# Altium project e-puck3-coreboard.PrjPcb (part 4 of 4)
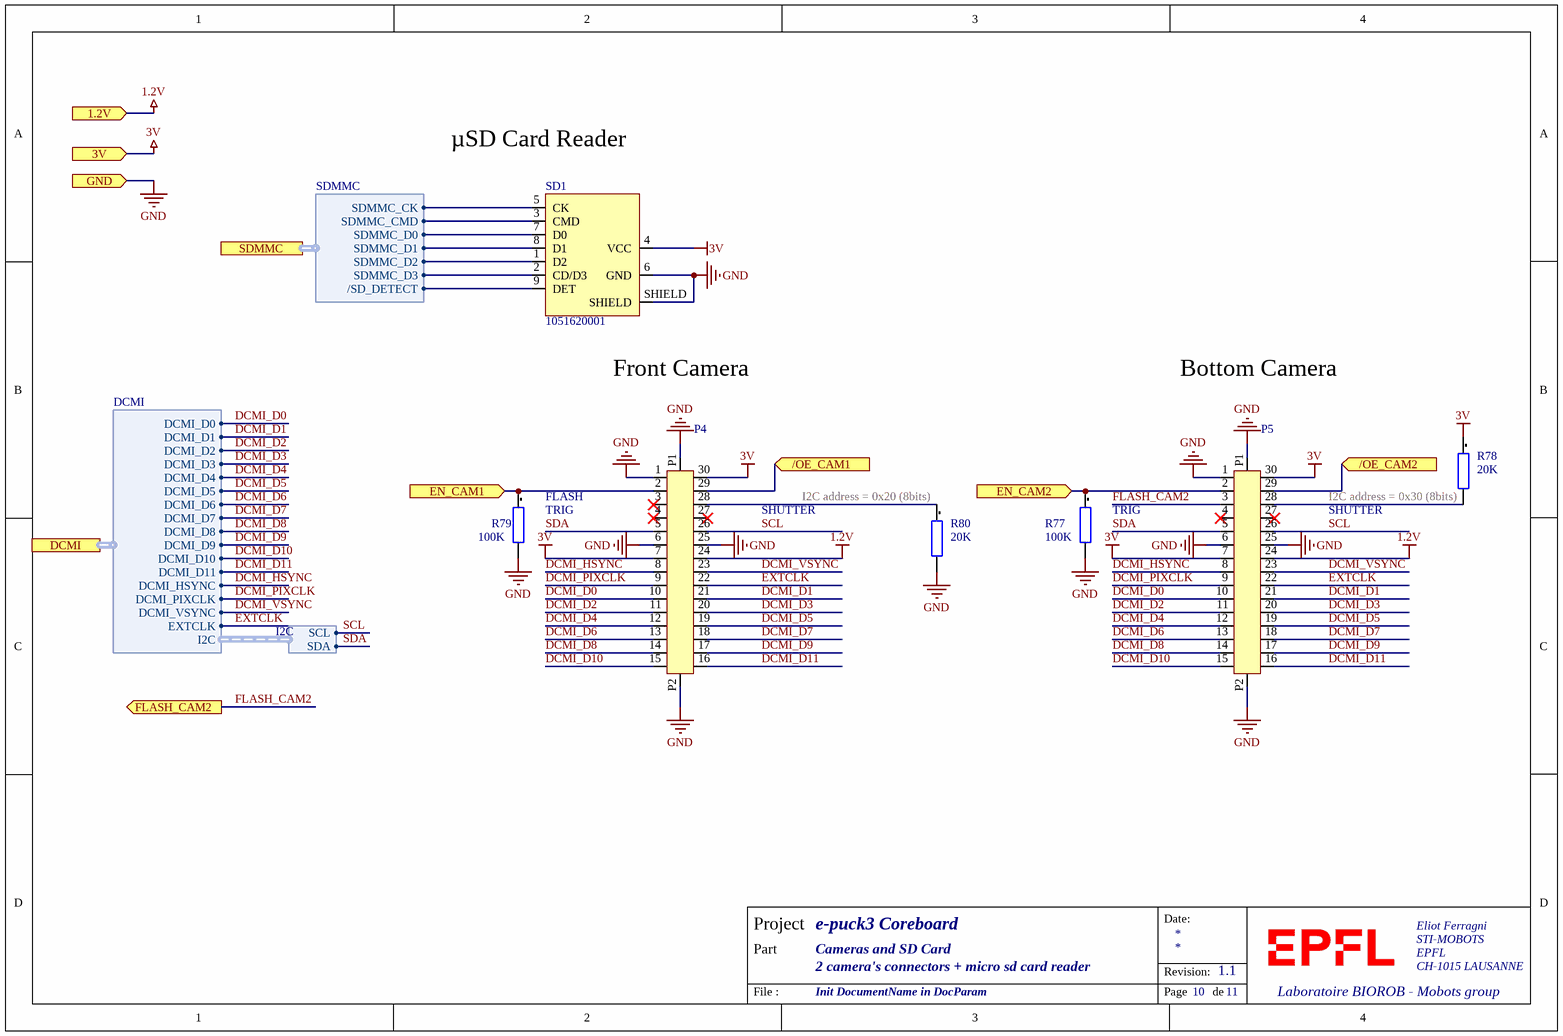
[diagram p11: Camera_sdcard.SchDoc]

## Nets that join several sheets
1.2V: Power (C46.1 U9.1), Camera_sdcard (P4.24 P5.24)
3V: Programmer (36 pins), Power (20 pins), USB (12 pins), Sensors + CAN (31 pins), Wireless (C65.1 C66.1 U17.2), Main_uC (34 pins), Extension_Connectors (J2.4 J3.3 J4.52 J5.51), U1_ESC (R36_1.1 R37_1.1), U2_ESC (R36_2.1 R37_2.1), U3_ESC (R36_3.1 R37_3.1), U4_ESC (R36_4.1 R37_4.1), Camera_sdcard (6 pins)
BAT+: Power (C47.1 D2#1.1 R17.1 U10.2), Extension_Connectors (12 pins), U1_ESC (6 pins), U2_ESC (6 pins), U3_ESC (6 pins), U4_ESC (6 pins)
BAT-: Power (6 pins), Extension_Connectors (9 pins)
GND: Programmer (40 pins), Power (35 pins), USB (30 pins), Sensors + CAN (39 pins), Wireless (7 pins), Main_uC (40 pins), Extension_Connectors (28 pins), U1_ESC (12 pins), U2_ESC (12 pins), U3_ESC (12 pins), U4_ESC (12 pins), Camera_sdcard (15 pins)
VBUS: Power (C43.1 D1#1.1 R16.1 U8.2), USB (6 pins), Extension_Connectors (6 pins)
26MHz_HUB_PROG: Programmer (U3.J11 X2.3), USB (U16.B3)
26MHz_PHY_HS: USB (U14.A2), Main_uC (U1.E2)
/BYPASS_HUB: Programmer (U2.C1), USB (U16.A5)
/CS_ENCODERS./CS_ENCODER_1: Programmer (U3.K2), Extension_Connectors (J5.28)
/CS_ENCODERS./CS_ENCODER_2: Programmer (U3.L5), Extension_Connectors (J5.30)
/CS_ENCODERS./CS_ENCODER_3: Programmer (U3.M4), Extension_Connectors (J5.32)
/CS_ENCODERS./CS_ENCODER_4: Programmer (U3.K6), Extension_Connectors (J5.34)
/CS_IMU: Sensors + CAN (U20.12), Main_uC (U1.N9)
/CS_PRESS: Sensors + CAN (U23.6), Main_uC (U1.K7)
/EN_CAN_PROG: Programmer (U3.N1), Sensors + CAN (U21.5)
/EN_CAN_uC: Sensors + CAN (U19.5), Main_uC (U1.F9)
/EN_PHY_HS: USB (C63.1 R72.1 U14.C2), Main_uC (U1.H10)
/INT_PD_CTRL: Programmer (U3.G6), USB (U12.B2)
/OE_CAM1: Main_uC (U1.C9), Camera_sdcard (P4.29)
/OE_CAM2: Main_uC (U1.B10), Camera_sdcard (P5.29)
/PWR_ON_BTN_STATE: Programmer (U3.C6), Power (D3#1.1), Main_uC (U1.L10)
/RESET_HUB: Programmer (U3.F1), USB (R73.2 U16.E3)
/SPI_ESP_CS: Wireless (U17.29), Main_uC (U1.K6)
/uC_RESET: Programmer (R83.2), Main_uC (C19.1 SW2.2 U1.L11 X1.1)
ADC.ADC3_IN0: Main_uC (U1.M13), Extension_Connectors (J3.4 J5.52)
ADC.ADC3_IN1: Main_uC (U1.J11), Extension_Connectors (J3.6 J5.50)
ADC.ADC3_IN2: Main_uC (U1.J10), Extension_Connectors (J3.8 J5.48)
ADC.ADC3_IN8: Main_uC (U1.K11), Extension_Connectors (J3.10 J5.46)
ADC.ADC3_IN9: Main_uC (U1.H11), Extension_Connectors (J3.12 J5.44)
ADC.ADC3_IN11: Main_uC (U1.L13), Extension_Connectors (J3.14 J5.42)
ADC.ADC3_IN14: Main_uC (U1.H12), Extension_Connectors (J3.16 J5.40)
ADC.ADC3_IN15: Main_uC (U1.H13), Extension_Connectors (J3.18)
BYPASS_PROG: Programmer (R6.1), Main_uC (U1.L1)
CAN1.RX: Sensors + CAN (U19.4), Main_uC (U1.A4)
CAN1.TX: Sensors + CAN (U19.1), Main_uC (U1.D5)
CAN_BUS.CANH: Sensors + CAN (J1.1 U19.7 U21.7), Extension_Connectors (J2.17 J4.37)
CAN_BUS.CANL: Sensors + CAN (R76.2 U19.6 U21.6), Extension_Connectors (J2.19 J4.35)
CAN_PROG.RX: Programmer (U3.B3), Sensors + CAN (U21.4)
CAN_PROG.TX: Programmer (U3.C4), Sensors + CAN (U21.1)
DAC1: Main_uC (U1.L9), Extension_Connectors (J3.5 J5.49)
DCMI.DCMI_D0: Main_uC (U1.K4), Camera_sdcard (P4.10 P5.10)
DCMI.DCMI_D1: Main_uC (U1.F5), Camera_sdcard (P4.21 P5.21)
DCMI.DCMI_D2: Main_uC (U1.A7), Camera_sdcard (P4.11 P5.11)
DCMI.DCMI_D3: Main_uC (U1.P3), Camera_sdcard (P4.20 P5.20)
DCMI.DCMI_D4: Main_uC (U1.F7), Camera_sdcard (P4.12 P5.12)
DCMI.DCMI_D5: Main_uC (U1.D10), Camera_sdcard (P4.19 P5.19)
DCMI.DCMI_D6: Main_uC (U1.C11), Camera_sdcard (P4.13 P5.13)
DCMI.DCMI_D7: Main_uC (U1.B12), Camera_sdcard (P4.18 P5.18)
DCMI.DCMI_D8: Main_uC (U1.B3), Camera_sdcard (P4.14 P5.14)
DCMI.DCMI_D9: Main_uC (U1.C3), Camera_sdcard (P4.17 P5.17)
DCMI.DCMI_D10: Main_uC (U1.D3), Camera_sdcard (P4.15 P5.15)
DCMI.DCMI_D11: Main_uC (U1.E5), Camera_sdcard (P4.16 P5.16)
DCMI.DCMI_HSYNC: Main_uC (U1.M5), Camera_sdcard (P4.8 P5.8)
DCMI.DCMI_PIXCLK: Main_uC (U1.N10), Camera_sdcard (P4.9 P5.9)
DCMI.DCMI_VSYNC: Main_uC (U1.D11), Camera_sdcard (P4.23 P5.23)
DCMI.EXTCLK: Main_uC (U1.K2), Camera_sdcard (P4.22 P5.22)
DFSDM.CLK: Sensors + CAN (MIC1.3 MIC2.3 MIC3.3 MIC4.3), Main_uC (U1.M2)
DFSDM.MIC12: Sensors + CAN (MIC1.4 MIC2.4), Main_uC (U1.C12)
DFSDM.MIC34: Sensors + CAN (MIC3.4 MIC4.4), Main_uC (U1.L6)
EN_CAM1: Main_uC (U1.L4), Camera_sdcard (P4.2 R79.1)
EN_CAM2: Main_uC (U1.M4), Camera_sdcard (P5.2 R77.1)
EN_DIST: Sensors + CAN (R75.1 U18.5), Main_uC (U1.K10)
EN_EXTENSION_BOT: Programmer (U3.E5), Extension_Connectors (J5.36)
EN_EXTENSION_TOP: Programmer (U3.C3), Extension_Connectors (J3.20)
FLASH_CAM2: Extension_Connectors (J5.38), Camera_sdcard (P5.3)
FREE_GPIOs_ESP32.IO21_ESP32: Wireless (U17.33), Extension_Connectors (J3.7 J5.47)
FREE_GPIOs_ESP32.IO22_ESP32: Wireless (U17.36), Extension_Connectors (J3.9 J5.45)
FREE_GPIOs_ESP32.IO27_ESP32: Wireless (U17.10), Extension_Connectors (J3.11 J5.43)
FREE_GPIOs_ESP32.IO32_ESP32: Wireless (U17.8), Extension_Connectors (J3.13 J5.41)
GPIOs_ESP32.EN_ESP32: Programmer (U3.A9), Wireless (R74.1 U17.3)
GPIOs_ESP32.GPIO0_ESP32: Programmer (U3.B9), Wireless (U17.25)
GPIOs_ESP32.IO4_ESP32: Programmer (U3.C10), Wireless (U17.26)
GPIOs_ESP32.IO13_ESP32: Programmer (U3.F11), Wireless (U17.16)
HUB_CONNECT: Programmer (U3.E9), USB (R68.2 U16.B5)
I2C1.SCL: Sensors + CAN (U18.10), Main_uC (R3.2 U1.B9), Extension_Connectors (J2.6 J4.50)
I2C1.SDA: Sensors + CAN (U18.9), Main_uC (R2.2 U1.C8), Extension_Connectors (J2.8 J4.48)
I2C2.SCL: Main_uC (U1.G12), Extension_Connectors (J2.10 J4.46)
I2C2.SDA: Main_uC (U1.N11), Extension_Connectors (J2.12 J4.44)
I2C4.SCL: Main_uC (R82#2.2 U1.J4), Extension_Connectors (J2.14 J4.42), Camera_sdcard (P4.26 P5.26)
I2C4.SDA: Main_uC (R81.2 U1.L2), Extension_Connectors (J2.16 J4.40), Camera_sdcard (P4.5 P5.5)
I2C_USB.SCL: Programmer (U3.L6), USB (R65.2 U12.B3 U16.E5)
I2C_USB.SDA: Programmer (U3.H5), USB (R64.2 U12.C3 U16.D5)
IMU_INT1: Sensors + CAN (U20.4), Main_uC (U1.A5)
IMU_INT2: Sensors + CAN (U20.9), Main_uC (U1.N7)
IR_SIGNAL: Sensors + CAN (U22.3), Main_uC (U1.F10)
Motor1.Phase1: Extension_Connectors (J4.17 J4.18), U1_ESC (P2_1.1 R30_1.1 U11_1.9 U11_1.26)
Motor1.Phase2: Extension_Connectors (J4.19 J4.20), U1_ESC (P2_1.2 R31_1.1 U11_1.11 U11_1.24)
Motor1.Phase3: Extension_Connectors (J4.21 J4.22), U1_ESC (P2_1.3 R32_1.1 U11_1.13 U11_1.22)
Motor2.Phase1: Extension_Connectors (J5.21 J5.22), U2_ESC (P2_2.1 R30_2.1 U11_2.9 U11_2.26)
Motor2.Phase2: Extension_Connectors (J5.19 J5.20), U2_ESC (P2_2.2 R31_2.1 U11_2.11 U11_2.24)
Motor2.Phase3: Extension_Connectors (J5.17 J5.18), U2_ESC (P2_2.3 R32_2.1 U11_2.13 U11_2.22)
Motor3.Phase1: Extension_Connectors (J5.9 J5.10), U3_ESC (P2_3.1 R30_3.1 U11_3.9 U11_3.26)
Motor3.Phase2: Extension_Connectors (J5.7 J5.8), U3_ESC (P2_3.2 R31_3.1 U11_3.11 U11_3.24)
Motor3.Phase3: Extension_Connectors (J5.5 J5.6), U3_ESC (P2_3.3 R32_3.1 U11_3.13 U11_3.22)
Motor4.Phase1: Extension_Connectors (J4.5 J4.6), U4_ESC (P2_4.1 R30_4.1 U11_4.9 U11_4.26)
Motor4.Phase2: Extension_Connectors (J4.7 J4.8), U4_ESC (P2_4.2 R31_4.1 U11_4.11 U11_4.24)
Motor4.Phase3: Extension_Connectors (J4.9 J4.10), U4_ESC (P2_4.3 R32_4.1 U11_4.13 U11_4.22)
motor_ctrl_1./FAULT: Programmer (U3.N6), U1_ESC (U11_1.1)
motor_ctrl_1.ENABLE: Programmer (U3.M6), U1_ESC (U11_1.2)
motor_ctrl_1.Phase1_Csense: Programmer (U3.J10), U1_ESC (R37_1.2 R39_1.1 U11_1.15)
motor_ctrl_1.Phase1_N: Programmer (U3.M5), U1_ESC (U11_1.3)
motor_ctrl_1.Phase1_P: Programmer (U3.N5), U1_ESC (U11_1.6)
motor_ctrl_1.Phase1_Vsense: Programmer (U3.F7), U1_ESC (R30_1.2 R35_1.1)
motor_ctrl_1.Phase2_Csense: Programmer (U3.J9), U1_ESC (R36_1.2 R38_1.1 U11_1.16)
motor_ctrl_1.Phase2_N: Programmer (U3.J4), U1_ESC (U11_1.4)
motor_ctrl_1.Phase2_P: Programmer (U3.K4), U1_ESC (U11_1.7)
motor_ctrl_1.Phase2_Vsense: Programmer (U3.F9), U1_ESC (R31_1.2 R34_1.1)
motor_ctrl_1.Phase3_N: Programmer (U3.L4), U1_ESC (U11_1.5)
motor_ctrl_1.Phase3_P: Programmer (U3.N4), U1_ESC (U11_1.8)
motor_ctrl_1.Phase3_Vsense: Programmer (U3.F8), U1_ESC (R32_1.2 R33_1.1)
motor_ctrl_2./FAULT: Programmer (U3.K5), U2_ESC (U11_2.1)
motor_ctrl_2.ENABLE: Programmer (U3.F10), U2_ESC (U11_2.2)
motor_ctrl_2.Phase1_Csense: Programmer (U3.M10), U2_ESC (R37_2.2 R39_2.1 U11_2.15)
motor_ctrl_2.Phase1_N: Programmer (U3.B7), U2_ESC (U11_2.3)
motor_ctrl_2.Phase1_P: Programmer (U3.C2), U2_ESC (U11_2.6)
motor_ctrl_2.Phase1_Vsense: Programmer (U3.G8), U2_ESC (R30_2.2 R35_2.1)
motor_ctrl_2.Phase2_Csense: Programmer (U3.M9), U2_ESC (R36_2.2 R38_2.1 U11_2.16)
motor_ctrl_2.Phase2_N: Programmer (U3.N3), U2_ESC (U11_2.4)
motor_ctrl_2.Phase2_P: Programmer (U3.M3), U2_ESC (U11_2.7)
motor_ctrl_2.Phase2_Vsense: Programmer (U3.G9), U2_ESC (R31_2.2 R34_2.1)
motor_ctrl_2.Phase3_N: Programmer (U3.C8), U2_ESC (U11_2.5)
motor_ctrl_2.Phase3_P: Programmer (U3.C7), U2_ESC (U11_2.8)
motor_ctrl_2.Phase3_Vsense: Programmer (U3.H8), U2_ESC (R32_2.2 R33_2.1)
motor_ctrl_3./FAULT: Programmer (U3.J1), U3_ESC (U11_3.1)
motor_ctrl_3.ENABLE: Programmer (U3.B6), U3_ESC (U11_3.2)
motor_ctrl_3.Phase1_Csense: Programmer (U3.N10), U3_ESC (R37_3.2 R39_3.1 U11_3.15)
motor_ctrl_3.Phase1_N: Programmer (U3.E3), U3_ESC (U11_3.3)
motor_ctrl_3.Phase1_P: Programmer (U3.N8), U3_ESC (U11_3.6)
motor_ctrl_3.Phase1_Vsense: Programmer (U3.G10), U3_ESC (R30_3.2 R35_3.1)
motor_ctrl_3.Phase2_Csense: Programmer (U3.N9), U3_ESC (R36_3.2 R38_3.1 U11_3.16)
motor_ctrl_3.Phase2_N: Programmer (U3.B8), U3_ESC (U11_3.4)
motor_ctrl_3.Phase2_P: Programmer (U3.H6), U3_ESC (U11_3.7)
motor_ctrl_3.Phase2_Vsense: Programmer (U3.H11), U3_ESC (R31_3.2 R34_3.1)
motor_ctrl_3.Phase3_N: Programmer (U3.K1), U3_ESC (U11_3.5)
motor_ctrl_3.Phase3_P: Programmer (U3.J2), U3_ESC (U11_3.8)
motor_ctrl_3.Phase3_Vsense: Programmer (U3.G11), U3_ESC (R32_3.2 R33_3.1)
motor_ctrl_4./FAULT: Programmer (U3.G3), U4_ESC (U11_4.1)
motor_ctrl_4.ENABLE: Programmer (U3.D8), U4_ESC (U11_4.2)
motor_ctrl_4.Phase1_Csense: Programmer (U3.K7), U4_ESC (R37_4.2 R39_4.1 U11_4.15)
motor_ctrl_4.Phase1_N: Programmer (U3.L8), U4_ESC (U11_4.3)
motor_ctrl_4.Phase1_P: Programmer (U3.F2), U4_ESC (U11_4.6)
motor_ctrl_4.Phase1_Vsense: Programmer (U3.K8), U4_ESC (R30_4.2 R35_4.1)
motor_ctrl_4.Phase2_Csense: Programmer (U3.M8), U4_ESC (R36_4.2 R38_4.1 U11_4.16)
motor_ctrl_4.Phase2_N: Programmer (U3.K3), U4_ESC (U11_4.4)
motor_ctrl_4.Phase2_P: Programmer (U3.F3), U4_ESC (U11_4.7)
motor_ctrl_4.Phase2_Vsense: Programmer (U3.L9), U4_ESC (R31_4.2 R34_4.1)
motor_ctrl_4.Phase3_N: Programmer (U3.J3), U4_ESC (U11_4.5)
motor_ctrl_4.Phase3_P: Programmer (U3.E4), U4_ESC (U11_4.8)
motor_ctrl_4.Phase3_Vsense: Programmer (U3.M11), U4_ESC (R32_4.2 R33_4.1)
POWER_MANAGEMENT.BAT+_INRUSH_LIMIT: Programmer (U3.L7), Power (R66.2 T5.1)
POWER_MANAGEMENT.BAT+_SENSE: Programmer (U3.K11), Power (U7.1 U7.2)
POWER_MANAGEMENT.PRIORITY_TO_VBUS: Programmer (U3.M7), Power (R21.2 T4.2)
POWER_MANAGEMENT.PWR_ON: Programmer (U3.M2), Power (R25.1 T2.2)
POWER_MANAGEMENT.PWR_ON_DFU: Programmer (R8.1 SW5.1 U3.C9), Power (R27.1 T3.2)
POWER_MANAGEMENT.VBUS_SENSE: Programmer (U3.K9), Power (U5.4 U6.1 U6.2)
PRESS_INT: Sensors + CAN (U23.7), Main_uC (U1.K3)
PWR_ON: Power (R26.1 T2.5), Main_uC (U1.G13)
SDMMC./SD_DETECT: Main_uC (U1.M9), Camera_sdcard (SD1.9)
SDMMC.SDMMC_CK: Main_uC (U1.D4), Camera_sdcard (SD1.5)
SDMMC.SDMMC_CMD: Main_uC (U1.D6), Camera_sdcard (SD1.3)
SDMMC.SDMMC_D0: Main_uC (U1.G8), Camera_sdcard (SD1.7)
SDMMC.SDMMC_D1: Main_uC (U1.E1), Camera_sdcard (SD1.8)
SDMMC.SDMMC_D2: Main_uC (U1.B4), Camera_sdcard (SD1.1)
SDMMC.SDMMC_D3: Main_uC (U1.C4), Camera_sdcard (SD1.2)
SPI1.MISO: Main_uC (U1.D12), Extension_Connectors (J2.25 J4.29)
SPI1.MISO: Main_uC (U1.C6), Extension_Connectors (J3.17 J5.37)
SPI1.MOSI: Main_uC (U1.E7), Extension_Connectors (J3.15 J5.39)
SPI1.MOSI: Main_uC (U1.E11), Extension_Connectors (J2.23 J4.31)
SPI1.SCK: Main_uC (U1.E10), Extension_Connectors (J2.27 J4.27)
SPI1.SCK: Main_uC (U1.B7), Extension_Connectors (J3.19 J5.35)
SPI2.MISO: Sensors + CAN (U20.1 U23.5), Main_uC (U1.N3)
SPI2.MOSI: Sensors + CAN (U20.14 U23.4), Main_uC (U1.N2)
SPI2.SCK: Sensors + CAN (U20.13 U23.2), Main_uC (U1.B5)
SPI3.MISO: Wireless (U17.31), Main_uC (U1.D8)
SPI3.MOSI: Wireless (U17.37), Main_uC (U1.J7)
SPI3.SCK: Wireless (U17.30), Main_uC (U1.E8)
SPI_BUS.MISO: Programmer (U3.A6), Extension_Connectors (J4.30)
SPI_BUS.MOSI: Programmer (U3.F6), Extension_Connectors (J4.28)
SPI_BUS.SCK: Programmer (U3.D6), Extension_Connectors (J4.32)
SWD_prog.SWCLK: Programmer (P1.1 U3.B1), Main_uC (U1.G4)
SWD_prog.SWDIO: Programmer (P1.3 U3.D3), Main_uC (U1.G5)
SWD_uC.SWCLK: Programmer (U3.D9), Main_uC (U1.A3)
SWD_uC.SWDIO: Programmer (U3.E8), Main_uC (U1.D2)
UART2_ESP32.RX: Programmer (U3.B2), Wireless (U17.17), Main_uC (U1.D9)
UART2_ESP32.TX: Main (R1.2), Wireless (U17.18)
UART4.RX: Main_uC (U1.G10), Extension_Connectors (J2.18 J4.38)
UART4.TX: Main_uC (U1.F6), Extension_Connectors (J2.20 J4.36)
UART5_uC.RX: Main (R1.1), Programmer (U3.A2), Main_uC (U1.E9)
UART7.CTS: Main_uC (U1.J6), Extension_Connectors (J3.25 J5.29)
UART7.RTS: Main_uC (U1.P7), Extension_Connectors (J3.27 J5.27)
UART7.RX: Main_uC (U1.M7), Extension_Connectors (J3.21 J5.33)
UART7.TX: Main_uC (U1.F8), Extension_Connectors (J3.23 J5.31)
UART_PROG_ESP32.RX: Programmer (U3.A8), Wireless (U17.34)
UART_PROG_ESP32.TX: Programmer (U3.D5), Wireless (U17.35)
USART2.RX: Main_uC (U1.E6), Extension_Connectors (J2.13 J4.41)
USART2.TX: Main_uC (U1.C5), Extension_Connectors (J2.15 J4.39)
USART3.RX: Programmer (U3.A10), Main_uC (U1.L3)
USART3.TX: Programmer (U3.B10), Main_uC (U1.M3)
USART6.CTS: Main_uC (U1.C7), Extension_Connectors (J2.9 J4.45)
USART6.RTS: Main_uC (U1.D7), Extension_Connectors (J2.11 J4.43)
USART6.RX: Main_uC (U1.F3), Extension_Connectors (J2.5 J4.49)
USART6.TX: Main_uC (U1.G6), Extension_Connectors (J2.7 J4.47)
USB_FS.DM: USB (U16.D2), Main_uC (U1.E3)
USB_FS.DP: USB (U16.C2), Main_uC (U1.D1)
USB_FS.VBUS: USB (R67.2), Main_uC (U1.F4)
USB_HS.CLK: USB (U14.A5), Main_uC (U1.P11)
USB_HS.DATA0: USB (U14.B4), Main_uC (U1.M10)
USB_HS.DATA1: USB (U14.C5), Main_uC (U1.P10)
USB_HS.DATA2: USB (U14.C4), Main_uC (U1.J8)
USB_HS.DATA3: USB (U14.D5), Main_uC (U1.K5)
USB_HS.DATA4: USB (U14.D4), Main_uC (U1.L5)
USB_HS.DATA5: USB (U14.E5), Main_uC (U1.H8)
USB_HS.DATA6: USB (U14.E4), Main_uC (U1.J5)
USB_HS.DATA7: USB (U14.E3), Main_uC (U1.A9)
USB_HS.DIR: USB (U14.A4), Main_uC (U1.F11)
USB_HS.NXT: USB (U14.B5), Main_uC (U1.N12)
USB_HS.STP: USB (U14.A3), Main_uC (U1.L12)
USB_PROG.DM: Programmer (U3.D4), USB (U16.D1)
USB_PROG.DP: Programmer (U3.E1), USB (U16.C1)
USB_PROG.VBUS: Programmer (U3.E2), USB (R69.2)
VBUS_DEVICES: Programmer (U3.G4), USB (R67.1 R69.1)
VBUS_HOST: Programmer (U3.G5), Power (U5.1), USB (R68.1)